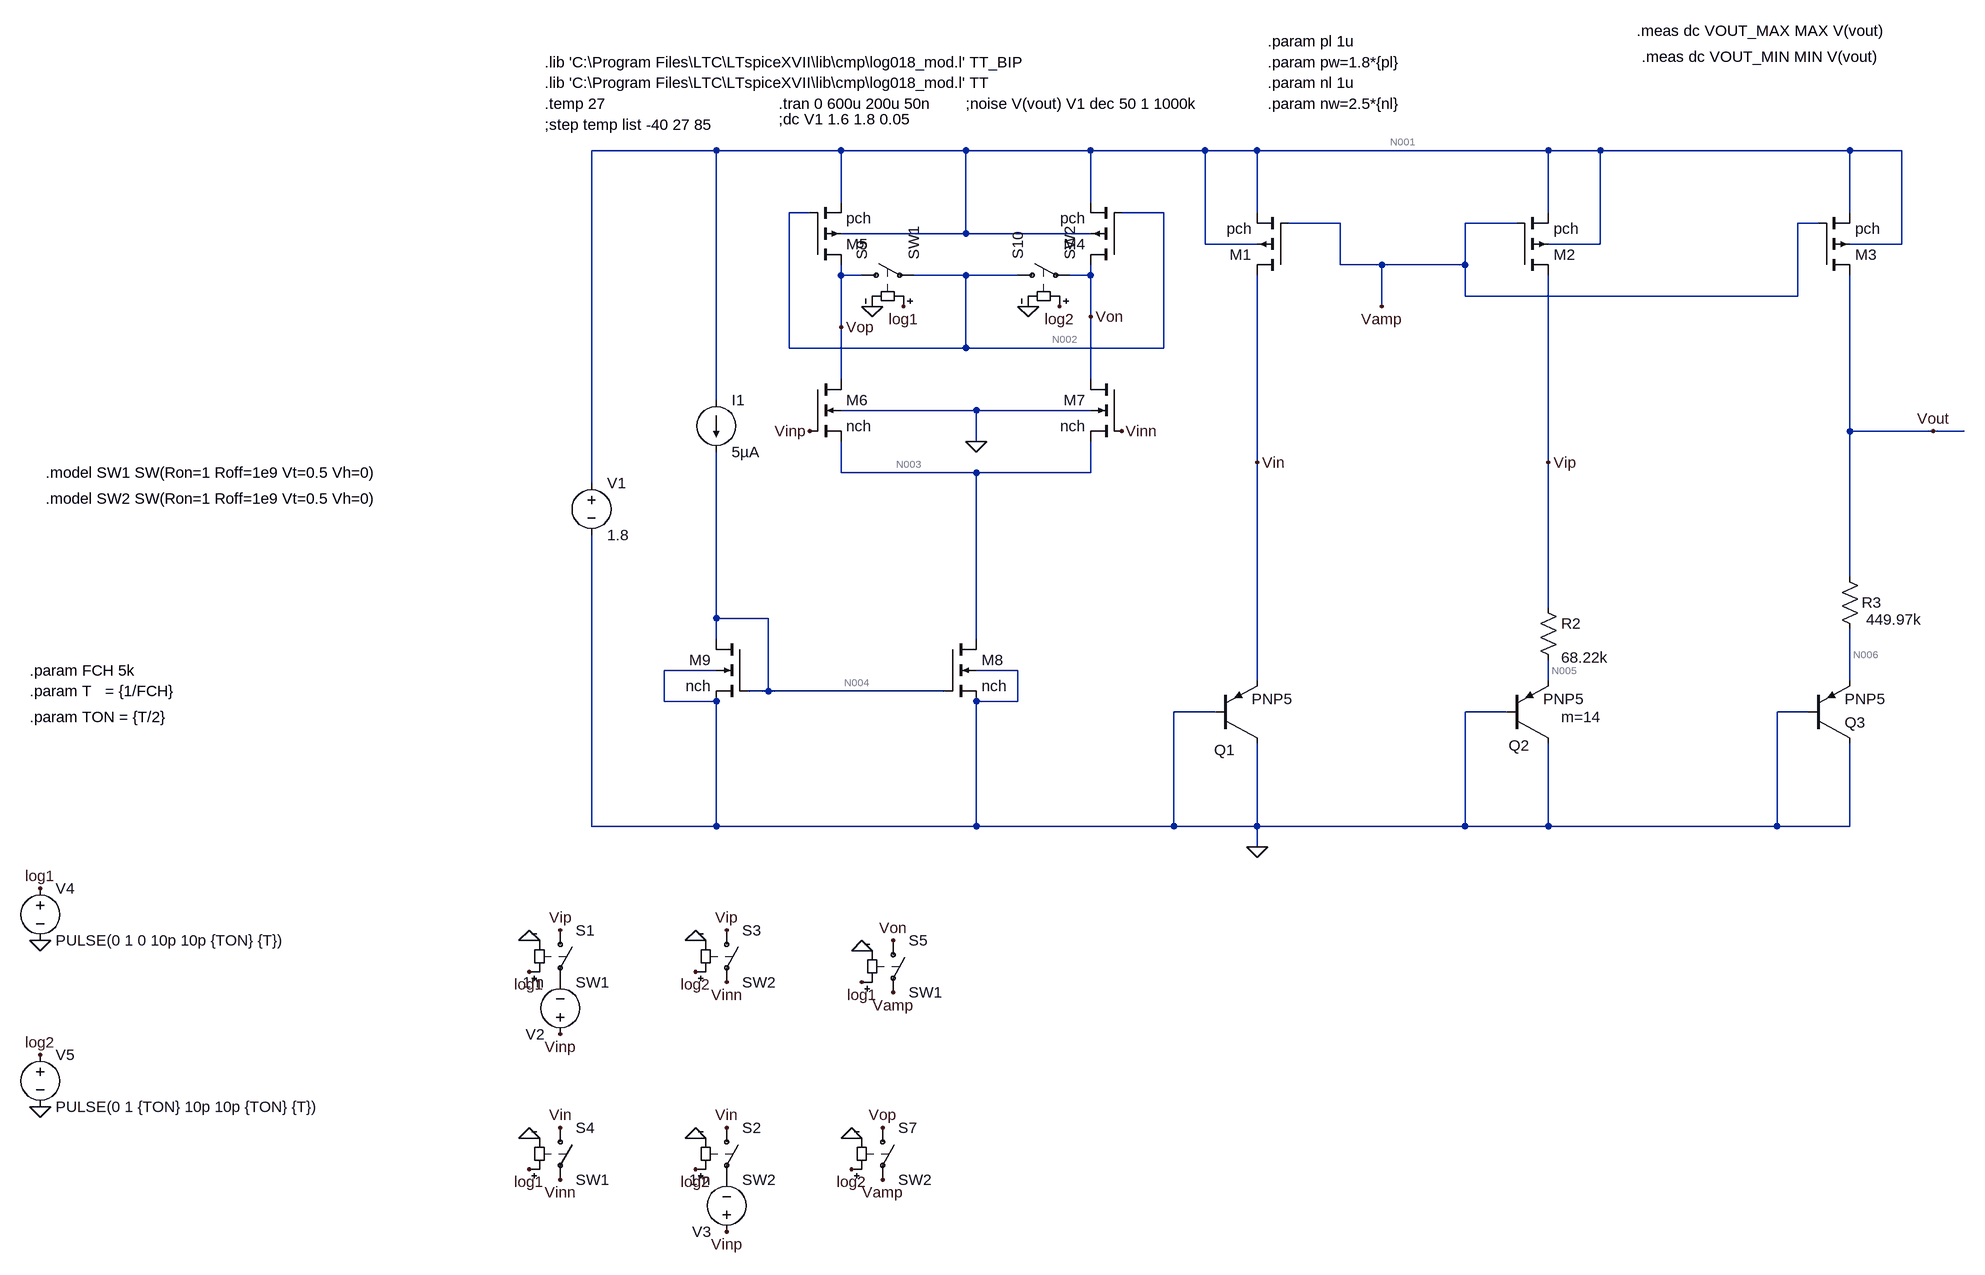
[diagram p0: schematic bandgap_g.asc]
bandgap_g.asc, the LTspice schematic file:
Version 4
SHEET 1 1940 2036
WIRE 16 176 -176 176
WIRE 208 176 16 176
WIRE 400 176 208 176
WIRE 592 176 400 176
WIRE 768 176 592 176
WIRE 848 176 768 176
WIRE 1296 176 848 176
WIRE 1376 176 1296 176
WIRE 1760 176 1376 176
WIRE 1840 176 1760 176
WIRE 208 256 208 176
WIRE 592 256 592 176
WIRE 160 272 128 272
WIRE 704 272 640 272
WIRE 848 272 848 176
WIRE 1296 272 1296 176
WIRE 1760 272 1760 176
WIRE 976 288 896 288
WIRE 1248 288 1168 288
WIRE 1712 288 1680 288
WIRE 400 304 400 176
WIRE 400 304 208 304
WIRE 592 304 400 304
WIRE 768 320 768 176
WIRE 848 320 768 320
WIRE 1376 320 1376 176
WIRE 1376 320 1296 320
WIRE 1840 320 1840 176
WIRE 1840 320 1760 320
WIRE 976 352 976 288
WIRE 1040 352 976 352
WIRE 1168 352 1168 288
WIRE 1168 352 1040 352
WIRE 208 368 208 352
WIRE 240 368 208 368
WIRE 400 368 320 368
WIRE 480 368 400 368
WIRE 592 368 592 352
WIRE 592 368 560 368
WIRE 1168 400 1168 352
WIRE 1680 400 1680 288
WIRE 1680 400 1168 400
WIRE 1040 416 1040 352
WIRE 592 432 592 368
WIRE 208 448 208 368
WIRE 128 480 128 272
WIRE 400 480 400 368
WIRE 400 480 128 480
WIRE 704 480 704 272
WIRE 704 480 400 480
WIRE 208 528 208 448
WIRE 592 528 592 432
WIRE 16 560 16 176
WIRE 416 576 208 576
WIRE 592 576 416 576
WIRE 1760 608 1760 368
WIRE 1888 608 1760 608
WIRE 1936 608 1888 608
WIRE 416 624 416 576
WIRE 848 656 848 368
WIRE 1296 656 1296 368
WIRE 208 672 208 624
WIRE 416 672 208 672
WIRE 592 672 592 624
WIRE 592 672 416 672
WIRE -176 688 -176 176
WIRE 1760 832 1760 608
WIRE 1296 880 1296 656
WIRE 16 896 16 640
WIRE 96 896 16 896
WIRE 16 928 16 896
WIRE 416 928 416 672
WIRE 16 976 -64 976
WIRE 480 976 416 976
WIRE 848 992 848 656
WIRE 1296 992 1296 960
WIRE 1760 992 1760 912
WIRE 96 1008 96 896
WIRE 96 1008 64 1008
WIRE 368 1008 96 1008
WIRE -64 1024 -64 976
WIRE 16 1024 -64 1024
WIRE 480 1024 480 976
WIRE 480 1024 416 1024
WIRE 784 1040 720 1040
WIRE 1232 1040 1168 1040
WIRE 1696 1040 1648 1040
WIRE -176 1216 -176 768
WIRE 16 1216 16 1024
WIRE 16 1216 -176 1216
WIRE 416 1216 416 1024
WIRE 416 1216 16 1216
WIRE 720 1216 720 1040
WIRE 720 1216 416 1216
WIRE 848 1216 848 1088
WIRE 848 1216 720 1216
WIRE 1168 1216 1168 1040
WIRE 1168 1216 848 1216
WIRE 1296 1216 1296 1088
WIRE 1296 1216 1168 1216
WIRE 1648 1216 1648 1040
WIRE 1648 1216 1296 1216
WIRE 1760 1216 1760 1088
WIRE 1760 1216 1648 1216
WIRE 848 1248 848 1216
FLAG 848 1248 0
FLAG 1888 608 Vout
FLAG 1296 656 Vip
FLAG 848 656 Vin
FLAG 416 624 0
FLAG 160 608 Vinp
FLAG 640 608 Vinn
FLAG 592 432 Von
FLAG -224 1376 Vip
FLAG 32 1680 Vin
FLAG 1040 416 Vamp
FLAG 32 1376 Vip
FLAG -224 1680 Vin
FLAG -224 1536 Vinp
FLAG 32 1840 Vinp
FLAG 32 1456 Vinn
FLAG -224 1760 Vinn
FLAG 208 448 Vop
FLAG 288 1392 Von
FLAG 272 1680 Vop
FLAG 288 1472 Vamp
FLAG 272 1760 Vamp
FLAG -1024 1312 log1
FLAG -1024 1568 log2
FLAG -1024 1392 0
FLAG -1024 1648 0
FLAG -272 1392 0
FLAG -16 1696 0
FLAG -16 1392 0
FLAG -272 1696 0
FLAG 240 1408 0
FLAG 224 1696 0
FLAG -272 1440 log1
FLAG 240 1456 log1
FLAG -16 1744 log2
FLAG 224 1744 log2
FLAG -272 1744 log1
FLAG -16 1440 log2
FLAG 304 416 log1
FLAG 544 416 log2
FLAG 256 416 0
FLAG 496 416 0
SYMBOL pnp2 784 1088 M180
WINDOW 0 -2 -11 Left 2
SYMATTR InstName Q1
SYMATTR Value PNP5
SYMBOL pnp2 1232 1088 M180
WINDOW 123 84 40 Left 2
WINDOW 0 3 -4 Left 2
SYMATTR Value2 m=14
SYMATTR InstName Q2
SYMATTR Value PNP5
SYMBOL voltage -176 672 R0
WINDOW 123 0 0 Left 0
WINDOW 39 0 0 Left 0
SYMATTR InstName V1
SYMATTR Value 1.8
SYMBOL pmos4 896 368 R180
SYMATTR InstName M1
SYMATTR Value pch
SYMATTR Value2 l=21u w=60u
SYMBOL pmos4 1248 368 M180
SYMATTR InstName M2
SYMATTR Value pch
SYMATTR Value2 l=21u w=60u
SYMBOL res 1280 864 R0
WINDOW 3 36 92 Left 2
SYMATTR Value 68.22k
SYMATTR InstName R2
SYMBOL pmos4 1712 368 M180
SYMATTR InstName M3
SYMATTR Value pch
SYMATTR Value2 l=21u w=60u
SYMBOL res 1744 816 R0
WINDOW 0 34 56 Left 2
WINDOW 3 41 82 Left 2
SYMATTR InstName R3
SYMATTR Value 449.97k
SYMBOL pnp2 1696 1088 M180
SYMATTR InstName Q3
SYMATTR Value PNP5
SYMBOL pmos4 640 352 R180
SYMATTR InstName M4
SYMATTR Value2 l={pl} w={pw}
SYMATTR Value pch
SYMBOL pmos4 160 352 M180
SYMATTR InstName M5
SYMATTR Value2 l={pl} w={pw}
SYMATTR Value pch
SYMBOL nmos4 160 528 R0
SYMATTR InstName M6
SYMATTR Value2 l={nl} w={nw}
SYMATTR Value nch
SYMBOL nmos4 640 528 M0
SYMATTR InstName M7
SYMATTR Value2 l={nl} w={nw}
SYMATTR Value nch
SYMBOL nmos4 368 928 R0
SYMATTR InstName M8
SYMATTR Value2 l={nl} w={nw}
SYMATTR Value nch
SYMBOL nmos4 64 928 M0
SYMATTR InstName M9
SYMATTR Value2 l={nl} w={nw}
SYMATTR Value nch
SYMBOL current 16 560 R0
WINDOW 123 0 0 Left 0
WINDOW 39 0 0 Left 0
SYMATTR InstName I1
SYMATTR Value 5µA
SYMBOL sw -224 1360 R0
SYMATTR InstName S1
SYMATTR Value SW1
SYMBOL sw 32 1664 R0
SYMATTR InstName S2
SYMATTR Value SW2
SYMBOL sw 32 1360 R0
SYMATTR InstName S3
SYMATTR Value SW2
SYMBOL sw -224 1664 R0
SYMATTR InstName S4
SYMATTR Value SW1
SYMBOL sw 288 1376 R0
SYMATTR InstName S5
SYMATTR Value SW1
SYMBOL sw 272 1664 R0
SYMATTR InstName S7
SYMATTR Value SW2
SYMBOL voltage -224 1552 R180
WINDOW 123 0 0 Left 0
WINDOW 39 0 0 Left 0
SYMATTR InstName V2
SYMATTR Value 1m
SYMBOL voltage 32 1856 R180
WINDOW 123 0 0 Left 0
WINDOW 39 0 0 Left 0
SYMATTR InstName V3
SYMATTR Value 1m
SYMBOL voltage -1024 1296 R0
WINDOW 123 0 0 Left 0
WINDOW 39 0 0 Left 0
SYMATTR InstName V4
SYMATTR Value PULSE(0 1 0 10p 10p {TON} {T})
SYMBOL voltage -1024 1552 R0
WINDOW 123 0 0 Left 0
WINDOW 39 0 0 Left 0
SYMATTR InstName V5
SYMATTR Value PULSE(0 1 {TON} 10p 10p {TON} {T})
SYMBOL sw 224 368 R270
SYMATTR InstName S9
SYMATTR Value SW1
SYMBOL sw 464 368 R270
SYMATTR InstName S10
SYMATTR Value SW2
TEXT -248 104 Left 2 !.temp 27
TEXT -248 72 Left 2 !.lib 'C:\\Program Files\\LTC\\LTspiceXVII\\lib\\cmp\\log018_mod.l' TT
TEXT -248 40 Left 2 !.lib 'C:\\Program Files\\LTC\\LTspiceXVII\\lib\\cmp\\log018_mod.l' TT_BIP
TEXT 112 104 Left 2 !.tran 0 600u 200u 50n
TEXT 400 104 Left 2 !;noise V(vout) V1 dec 50 1 1000k
TEXT 864 8 Left 2 !.param pl 1u
TEXT 864 40 Left 2 !.param pw=1.8*{pl}
TEXT 864 72 Left 2 !.param nl 1u
TEXT 864 104 Left 2 !.param nw=2.5*{nl}
TEXT 112 128 Left 2 !;dc V1 1.6 1.8 0.05
TEXT -248 136 Left 2 !;step temp list -40 27 85
TEXT 1432 -8 Left 2 !.meas dc VOUT_MAX MAX V(vout)
TEXT 1440 32 Left 2 !.meas dc VOUT_MIN MIN V(vout)
TEXT -1040 1008 Left 2 !.param T   = {1/FCH}
TEXT -1040 1048 Left 2 !.param TON = {T/2}
TEXT -1040 976 Left 2 !.param FCH 5k
TEXT -1016 672 Left 2 !.model SW1 SW(Ron=1 Roff=1e9 Vt=0.5 Vh=0)
TEXT -1016 712 Left 2 !.model SW2 SW(Ron=1 Roff=1e9 Vt=0.5 Vh=0)

The netlist it stands for:
* bandgap_g.asc
Q1 0 0 Vin 0 PNP5
Q2 0 0 N005 0 PNP5 m=14
V1 N001 0 1.8
M1 Vin Vamp N001 N001 pch l=21u w=60u
M2 Vip Vamp N001 N001 pch l=21u w=60u
R2 Vip N005 68.22k
M3 Vout Vamp N001 N001 pch l=21u w=60u
R3 Vout N006 449.97k
Q3 0 0 N006 0 PNP5
M4 Von N002 N001 N001 pch l={pl} w={pw}
M5 Vop N002 N001 N001 pch l={pl} w={pw}
M6 Vop Vinp N003 0 nch l={nl} w={nw}
M7 Von Vinn N003 0 nch l={nl} w={nw}
M8 N003 N004 0 0 nch l={nl} w={nw}
M9 N004 N004 0 0 nch l={nl} w={nw}
I1 N001 N004 5µA
S1 Vip P001 log1 0 SW1
S2 Vin P002 log2 0 SW2
S3 Vip Vinn log2 0 SW2
S4 Vin Vinn log1 0 SW1
S5 Von Vamp log1 0 SW1
S7 Vop Vamp log2 0 SW2
V2 Vinp P001 1m
V3 Vinp P002 1m
V4 log1 0 PULSE(0 1 0 10p 10p {TON} {T})
V5 log2 0 PULSE(0 1 {TON} 10p 10p {TON} {T})
S9 Vop N002 log1 0 SW1
S10 N002 Von log2 0 SW2
.model NPN NPN
.model PNP PNP
.lib standard.bjt
.model NMOS NMOS
.model PMOS PMOS
.lib standard.mos
.temp 27
.lib 'C:\Program Files\LTC\LTspiceXVII\lib\cmp\log018_mod.l' TT
.lib 'C:\Program Files\LTC\LTspiceXVII\lib\cmp\log018_mod.l' TT_BIP
.tran 0 600u 200u 50n
;noise V(vout) V1 dec 50 1 1000k
.param pl 1u
.param pw=1.8*{pl}
.param nl 1u
.param nw=2.5*{nl}
;dc V1 1.6 1.8 0.05
;step temp list -40 27 85
.meas dc VOUT_MAX MAX V(vout)
.meas dc VOUT_MIN MIN V(vout)
.param T   = {1/FCH}
.param TON = {T/2}
.param FCH 5k
.model SW1 SW(Ron=1 Roff=1e9 Vt=0.5 Vh=0)
.model SW2 SW(Ron=1 Roff=1e9 Vt=0.5 Vh=0)
.backanno
.end

* Results of the author's LTspice run, read from the files saved beside the schematic
* Operating Point, zero values left out:
*   V(vin) = 711.1 mV
*   V(n005) = 643.1 mV
*   V(n001) = 1.8 V
*   V(vamp) = 1.142 V
*   V(vip) = 977.3 mV
*   V(vout) = 1.737 V
*   V(n006) = 691.8 mV
*   V(von) = 1.223 V
*   V(n002) = 1.142 V
*   V(vop) = 1.061 V
*   V(vinp) = 845.2 mV
*   V(n003) = 270.5 mV
*   V(vinn) = 844.2 mV
*   V(n004) = 547.3 mV
*   V(p001) = 844.2 mV
*   V(p002) = 844.2 mV
*   Ic(Q3) = -1.691 µA
*   Ib(Q3) = -632.2 nA
*   Ie(Q3) = 2.323 µA
*   Ic(Q2) = -3.569 µA
*   Ib(Q2) = -1.33 µA
*   Ie(Q2) = 4.899 µA
*   Ic(Q1) = -3.568 µA
*   Ib(Q1) = -1.338 µA
*   Ie(Q1) = 4.906 µA
*   Id(M9) = 5 µA
*   Is(M9) = -5 µA
*   Id(M8) = 4.882 µA
*   Is(M8) = -4.882 µA
*   Id(M7) = 2.432 µA
*   Ib(M7) = -2.784 pA
*   Is(M7) = -2.432 µA
*   Id(M6) = 2.45 µA
*   Ib(M6) = -1.396 pA
*   Is(M6) = -2.45 µA
*   Id(M5) = -2.45 µA
*   Is(M5) = 2.45 µA
*   Id(M4) = -2.432 µA
*   Is(M4) = 2.432 µA
*   Id(M3) = -2.323 µA
*   Is(M3) = 2.323 µA
*   Id(M2) = -4.899 µA
*   Is(M2) = 4.899 µA
*   Id(M1) = -4.906 µA
*   Ib(M1) = 1.099 pA
*   Is(M1) = 4.906 µA
*   I(I1) = 5 µA
*   I(R3) = 2.323 µA
*   I(R2) = 4.899 µA
*   I(S10) = 81.09 pA
*   I(S7) = 81.09 pA
*   I(S3) = -133.2 pA
*   I(S2) = 133.2 pA
*   I(S9) = 81.09 pA
*   I(S5) = -81.09 pA
*   I(S4) = 133.2 pA
*   I(S1) = -133.2 pA
*   I(V3) = 133.2 pA
*   I(V2) = -133.2 pA
*   I(V1) = -22.01 µA
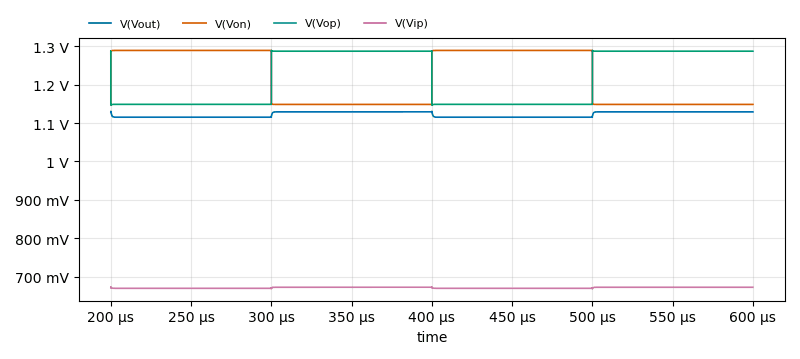
[diagram p1: Transient Analysis of bandgap_g.asc, plotted from the saved traces]
* Transient Analysis, 1 run:
*   V(Vout): min 1.115 V, max 1.131 V, average 1.122 V, rms 1.122 V, last 1.129 V
*   V(Von): min 1.148 V, max 1.289 V, average 1.219 V, rms 1.221 V, last 1.148 V
*   V(Vop): min 1.146 V, max 1.289 V, average 1.218 V, rms 1.22 V, last 1.287 V
*   V(Vip): min 668.6 mV, max 672.9 mV, average 671.2 mV, rms 671.2 mV, last 672.6 mV